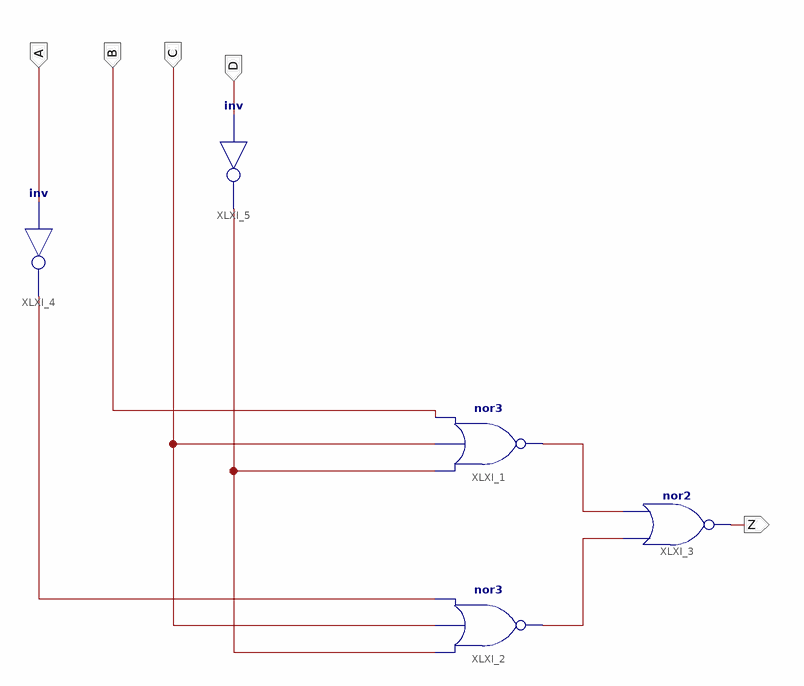
[diagram p0: schematic sheet 1]
// Xilinx ISE schematic p1ej3b.sch (spartan3) as structural Verilog: 5 symbols, 5 ports
module p1ej3b (
  input  A,
  input  C,
  input  B,
  input  D,
  output Z
);

  wire XLXN_11, XLXN_12, XLXN_15, XLXN_16;

  nor XLXI_1 (XLXN_15, XLXN_11, C, B);
  nor XLXI_2 (XLXN_16, XLXN_11, C, XLXN_12);
  nor XLXI_3 (Z, XLXN_16, XLXN_15);
  not XLXI_4 (XLXN_12, A);
  not XLXI_5 (XLXN_11, D);
endmodule
